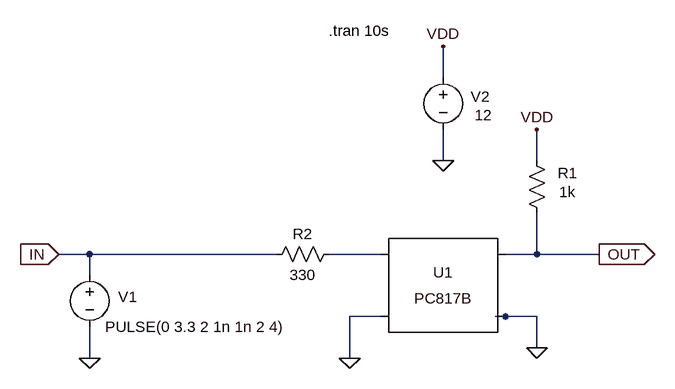
[diagram p0: schematic Opto_PC817.asc]
Opto_PC817.asc, the LTspice schematic file:
Version 4.1
SHEET 1 1116 680
WIRE 224 -144 224 -192
WIRE 224 -16 224 -64
WIRE 368 -16 368 -64
WIRE -320 128 -368 128
WIRE -32 128 -320 128
WIRE 128 128 48 128
WIRE 368 128 368 64
WIRE 368 128 320 128
WIRE 464 128 368 128
WIRE -320 160 -320 128
WIRE 128 224 80 224
WIRE 320 224 304 224
WIRE 368 224 320 224
WIRE 368 272 368 224
WIRE -320 288 -320 240
WIRE 80 288 80 224
FLAG 80 288 0
FLAG -320 288 0
FLAG 224 -16 0
FLAG -368 128 IN
IOPIN -368 128 In
FLAG 224 -192 VDD
FLAG 368 -64 VDD
FLAG 368 272 0
FLAG 464 128 OUT
IOPIN 464 128 Out
SYMBOL Optos\\PC817B 224 176 R0
SYMATTR InstName U1
SYMBOL res 352 -32 R0
WINDOW 0 48 35 Left 2
WINDOW 3 50 64 Left 2
SYMATTR InstName R1
SYMATTR Value 1k
SYMBOL voltage -320 144 R0
WINDOW 123 0 0 Left 0
WINDOW 39 0 0 Left 0
WINDOW 0 44 50 Left 2
SYMATTR InstName V1
SYMATTR Value PULSE(0 3.3 2 1n 1n 2 4)
SYMBOL res 64 112 R90
WINDOW 0 0 56 VBottom 2
WINDOW 3 32 56 VTop 2
SYMATTR InstName R2
SYMATTR Value 330
SYMBOL voltage 224 -160 R0
WINDOW 123 0 0 Left 0
WINDOW 39 0 0 Left 0
WINDOW 0 42 45 Left 2
WINDOW 3 48 74 Left 2
SYMATTR InstName V2
SYMATTR Value 12
TEXT 48 -216 Left 2 !.tran 10s

The netlist it stands for:
* Opto_PC817.asc
X§U1 N001 0 OUT 0 PC817 Igain=1.5m
R1 VDD OUT 1k
V1 IN 0 PULSE(0 3.3 2 1n 1n 2 4)
R2 N001 IN 330
V2 VDD 0 12
.tran 10s
.lib PC817.sub
.backanno
.end

* Results of the author's LTspice run, read from the files saved beside the schematic
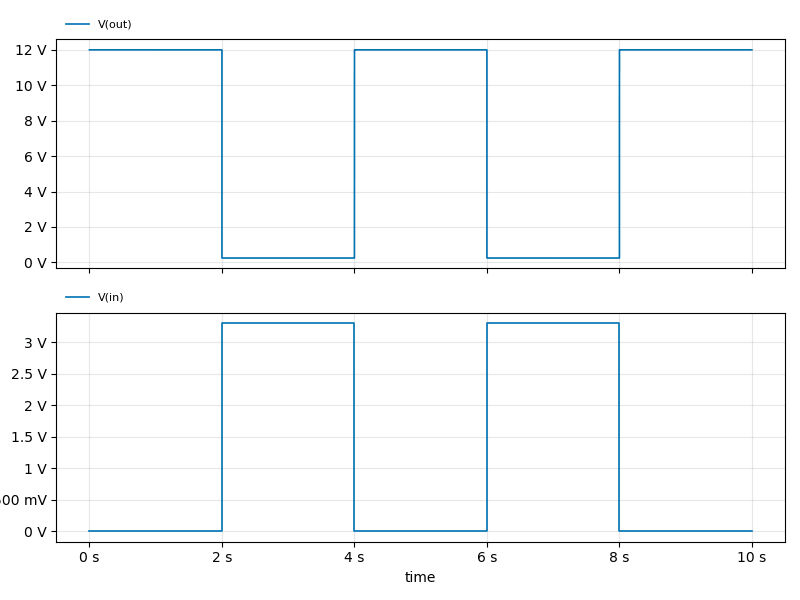
[diagram p1: Transient Analysis of Opto_PC817.asc, plotted from the saved traces]
* Transient Analysis, 1 run:
*   V(out): min 246.9 mV, max 12 V, average 7.299 V, rms 9.296 V, last 12 V
*   V(in): min 0 V, max 3.3 V, average 1.32 V, rms 2.087 V, last 0 V